# EAGLE design avionics-controller (EAGLE 9.2.2)

## Sheet 1 of 4
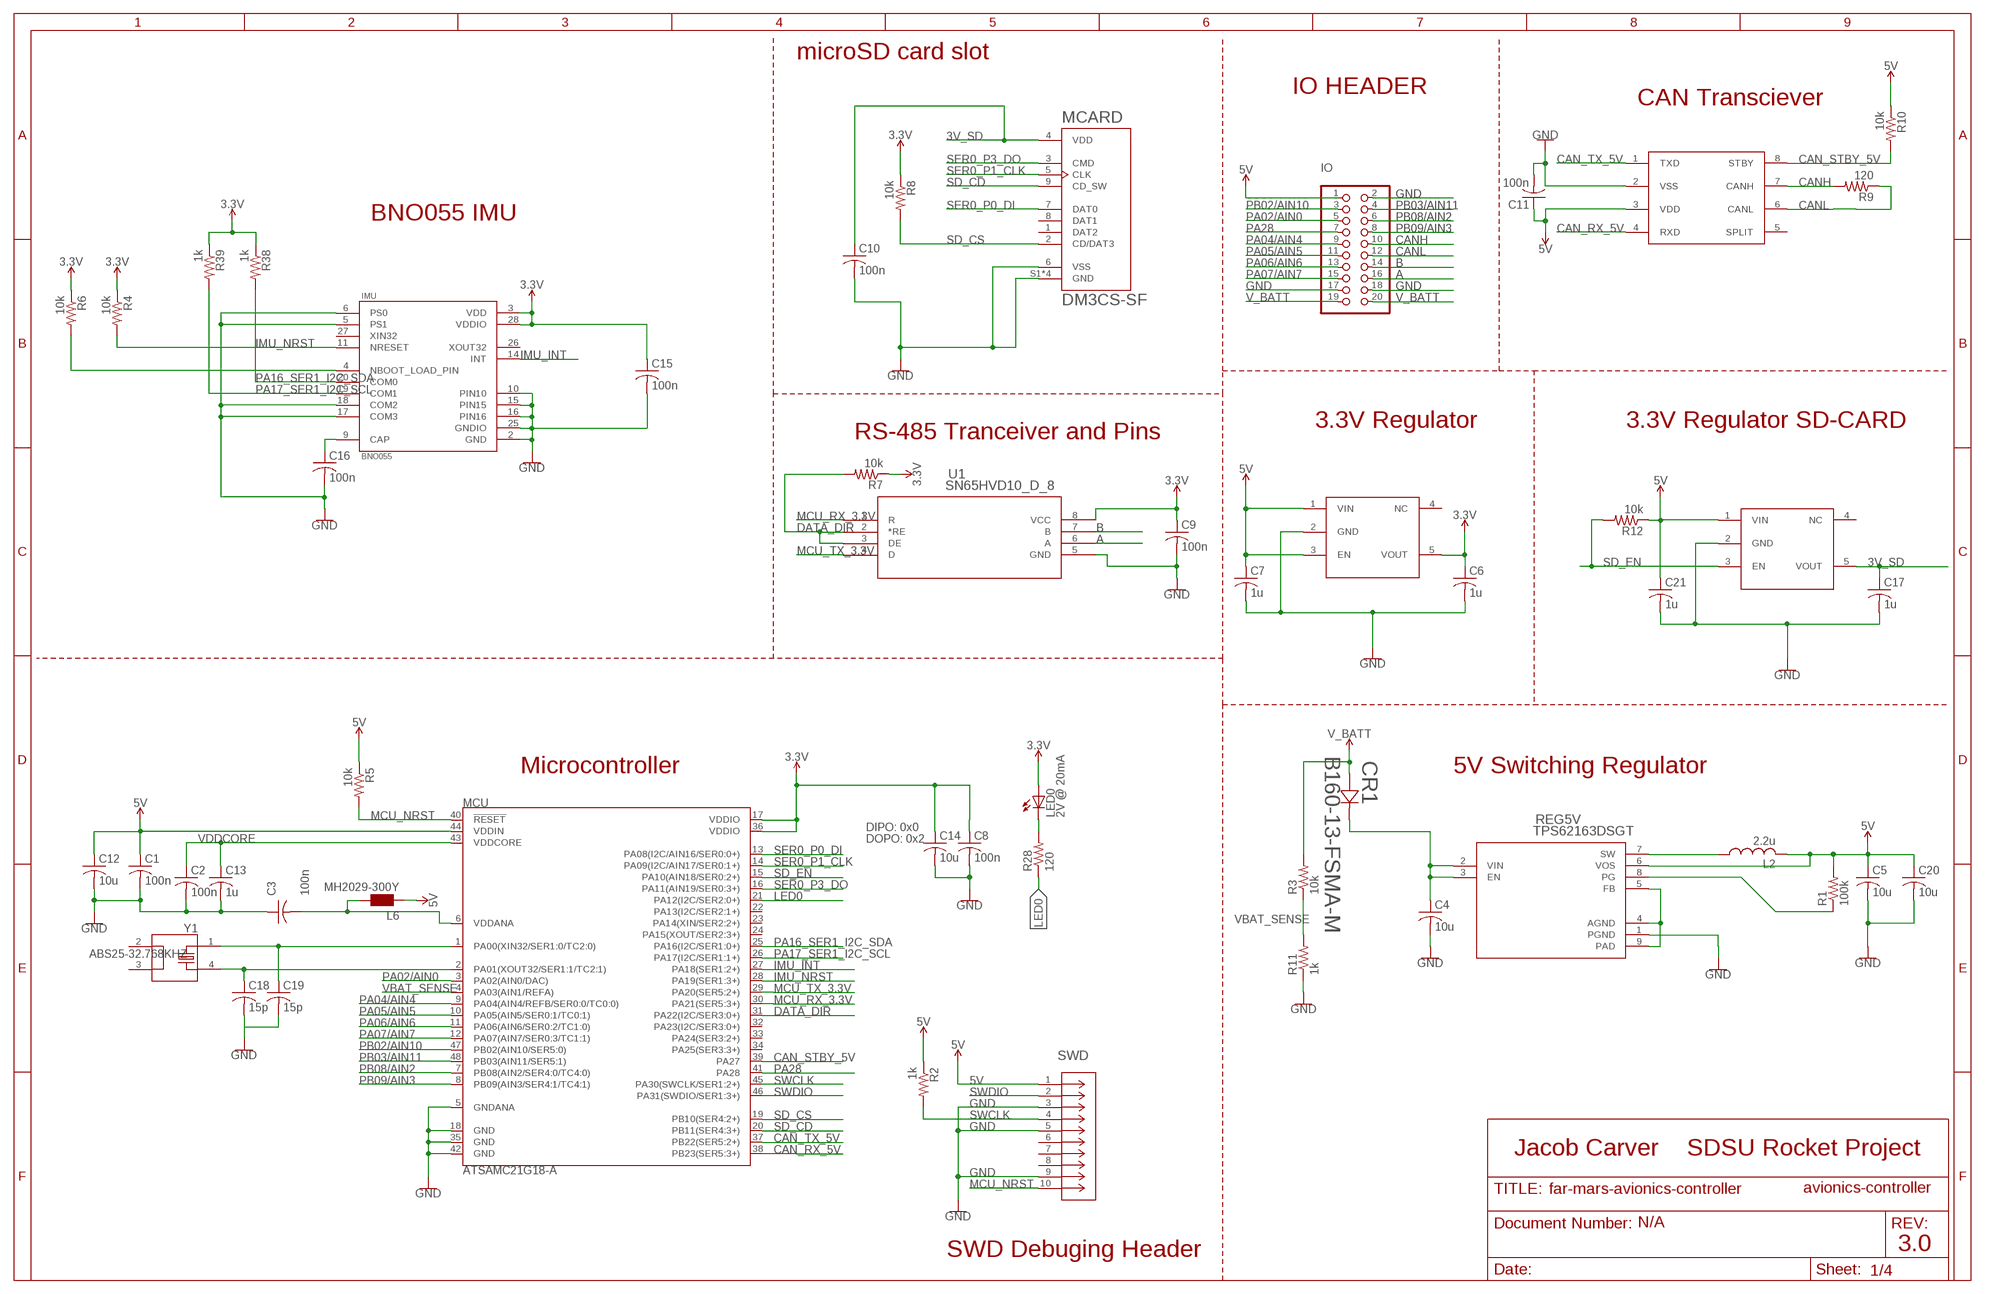
[diagram p0: schematic, sheet 1]

### Parts
3VREG  3.3VREGULATOR  [SOT95P280X110-5]
3VREG-SD  3.3VREGULATOR  [SOT95P280X110-5]
C1  100n  C-USC0402  [C0402]
C2  100n  C-USC0402  [C0402]
C3  100n  C-USC0402  [C0402]
C4  10u  C-USC0603  [C0603]
C5  10u  C-USC0603  [C0603]
C6  1u  C-USC0402  [C0402]
C7  1u  C-USC0402  [C0402]
C8  100n  C-USC0402  [C0402]
C9  100n  C-USC0402  [C0402]
C10  100n  C-USC0402  [C0402]
C11  100n  C-USC0402  [C0402]
C12  10u  C-USC0603  [C0603]
C13  1u  C-USC0402  [C0402]
C14  10u  C-USC0603  [C0603]
C15  100n  C-USC0402  [C0402]
C16  100n  C-USC0402  [C0402]
C17  1u  C-USC0402  [C0402]
C18  15p  C-USC0402  [C0402]
C19  15p  C-USC0402  [C0402]
C20  10u  C-USC0603  [C0603]
C21  1u  C-USC0402  [C0402]
CAN  MCP2561T-E8SOIC  [SOIC127P600X175-8]
CR1  B160-13-FSMA-M  [SMA-M]
IMU  BNO055  [LGA28R50P4X10_380X520X100]
IO  PINHD-2X10/90  [2X10/90]
L2  2.2u  L-USL2012C  [L2012C]
L6  MH2029-300Y  0001_BLM21PG300SN1D_/_MH2029-300Y  [0805]
LED0  2V @ 20mA  LEDCHIPLED_0603  [CHIPLED_0603]
MCARD  DM3CS-SF  [HRS_DM3CS-SF]
MCU  ATSAMC21G18-A  ATSAMD21G-A  [TQFP-48]
R1  100k  R-US_R0402  [R0402]
R2  1k  R-US_R0402  [R0402]
R3  10k  R-US_R0402  [R0402]
R4  10k  R-US_R0402  [R0402]
R5  10k  R-US_R0402  [R0402]
R6  10k  R-US_R0402  [R0402]
R7  10k  R-US_R0402  [R0402]
R8  10k  R-US_R0402  [R0402]
R9  120  R-US_R0402  [R0402]
R10  10k  R-US_R0402  [R0402]
R11  1k  R-US_R0402  [R0402]
R12  10k  R-US_R0402  [R0402]
R28  120  R-US_R0402  [R0402]
R38  1k  R-US_R0402  [R0402]
R39  1k  R-US_R0402  [R0402]
REG5V  TPS62163DSGT  [DSG8_1P6X0P9]
SWD  DEBUG-HEADER  [CONN_MINITEK_2X5_HDR]
U1  SN65HVD10_D_8  [D8]
Y1  ABS25-32.768KHZ  [ABS25-32.768KHZ-6-T]

### Nets
3.3V: 3VREG.5(VOUT) C6.1 C8.1 C9.1 C14.1 C15.1 IMU.3(VDD) IMU.28(VDDIO) LED0.A MCU.17(VDDIO) MCU.36(VDDIO) R4.1 R6.1 R7.1 R8.1 R38.1 R39.1 U1.8(VCC)
3V_SD: 3VREG-SD.5(VOUT) C10.1 C17.1 MCARD.4(VDD)
5V: 3VREG-SD.1(VIN) 3VREG.1(VIN) 3VREG.3(EN) C1.1 C5.1 C7.1 C11.1 C12.1 C20.1 C21.1 CAN.3(VDD) IO.1 L2.2 L6.1 MCU.44(VDDIN) R1.2 R2.1 R5.1 R10.1 R12.1 REG5V.6(VOS) SWD.1
A: IO.16 U1.6(A)
B: IO.14 U1.7(B)
CAN_RX_5V: CAN.4(RXD) MCU.38(PB23(SER5:3+))
CAN_STBY_5V: CAN.8(STBY) MCU.39(PA27) R10.2
CAN_TX_5V: CAN.1(TXD) MCU.37(PB22(SER5:2+))
CANH: CAN.7(CANH) IO.10 R9.2
CANL: CAN.6(CANL) IO.12 R9.1
DATA_DIR: MCU.31(PA22(I2C/SER3:0+)) R7.2 U1.2(*RE) U1.3(DE)
GND: 3VREG-SD.2(GND) 3VREG.2(GND) C1.2 C2.2 C3.1 C4.2 C5.2 C6.2 C7.2 C8.2 C9.2 C10.2 C11.2 C12.2 C13.2 C14.2 C15.2 C16.2 C17.2 C18.2 C19.2 C20.2 C21.2 CAN.2(VSS) IMU.2(GND) IMU.5(PS1) IMU.6(PS0) IMU.10(PIN10) IMU.15(PIN15) IMU.16(PIN16) IMU.17(COM3) IMU.18(COM2) IMU.25(GNDIO) IO.2 IO.17 IO.18 MCARD.6(VSS) MCARD.S1(GND) MCARD.S2(GND) MCARD.S3(GND) MCARD.S5(GND) MCU.5(GNDANA) MCU.18(GND) MCU.35(GND) MCU.42(GND) R11.1 REG5V.1(PGND) SWD.3 SWD.5 SWD.9 U1.5(GND)
IMU_INT: IMU.14(INT) MCU.27(PA18(SER1:2+))
IMU_NRST: IMU.11(NRESET) MCU.28(PA19(SER1:3+)) R4.2
LED0: MCU.21(PA12(I2C/SER2:0+)) R28.1
MCU_NRST: MCU.40(!RESET!) R5.2 SWD.10
MCU_RX_3.3V: MCU.30(PA21(SER5:3+)) U1.1(R)
MCU_TX_3.3V: MCU.29(PA20(SER5:2+)) U1.4(D)
N$1: R1.1 REG5V.8(PG)
N$2: C3.2 L6.2 MCU.6(VDDANA)
N$4: L2.1 REG5V.7(SW)
N$8: REG5V.4(AGND) REG5V.5(FB) REG5V.9(PAD)
N$9: C4.1 CR1.1 REG5V.2(VIN) REG5V.3(EN)
N$10: C19.1 MCU.1(PA00(XIN32/SER1:0/TC2:0)) Y1.1
N$11: C18.1 MCU.2(PA01(XOUT32/SER1:1/TC2:1)) Y1.4
N$15: C16.1 IMU.9(CAP)
N$18: IMU.4(NBOOT_LOAD_PIN) R6.2
N$20: LED0.C R28.2
PA02/AIN0: IO.5 MCU.3(PA02(AIN0/DAC))
PA04/AIN4: IO.9 MCU.9(PA04(AIN4/REFB/SER0:0/TC0:0))
PA05/AIN5: IO.11 MCU.10(PA05(AIN5/SER0:1/TC0:1))
PA06/AIN6: IO.13 MCU.11(PA06(AIN6/SER0:2/TC1:0))
PA07/AIN7: IO.15 MCU.12(PA07(AIN7/SER0:3/TC1:1))
PA16_SER1_I2C_SDA: IMU.20(COM0) MCU.25(PA16(I2C/SER1:0+)) R38.2
PA17_SER1_I2C_SCL: IMU.19(COM1) MCU.26(PA17(I2C/SER1:1+)) R39.2
PA28: IO.7 MCU.41(PA28)
PB02/AIN10: IO.3 MCU.47(PB02(AIN10/SER5:0))
PB03/AIN11: IO.4 MCU.48(PB03(AIN11/SER5:1))
PB08/AIN2: IO.6 MCU.7(PB08(AIN2/SER4:0/TC4:0))
PB09/AIN3: IO.8 MCU.8(PB09(AIN3/SER4:1/TC4:1))
SD_CD: MCARD.9(CD_SW) MCU.20(PB11(SER4:3+))
SD_CS: MCARD.2(CD/DAT3) MCU.19(PB10(SER4:2+)) R8.2
SD_EN: 3VREG-SD.3(EN) MCU.15(PA10(AIN18/SER0:2+)) R12.2
SER0_P0_DI: MCARD.7(DAT0) MCU.13(PA08(I2C/AIN16/SER0:0+))
SER0_P1_CLK: MCARD.5(CLK) MCU.14(PA09(I2C/AIN17/SER0:1+))
SER0_P3_DO: MCARD.3(CMD) MCU.16(PA11(AIN19/SER0:3+))
SWCLK: MCU.45(PA30(SWCLK/SER1:2+)) R2.2 SWD.4
SWDIO: MCU.46(PA31(SWDIO/SER1:3+)) SWD.2
V_BATT: CR1.2 IO.19 IO.20 R3.2
VBAT_SENSE: MCU.4(PA03(AIN1/REFA)) R3.1 R11.2
VDDCORE: C2.1 C13.1 MCU.43(VDDCORE)
Unconnected: 3VREG-SD.4(NC) 3VREG.4(NC) CAN.5(SPLIT) IMU.26(XOUT32) IMU.27(XIN32) MCARD.1(DAT2) MCARD.8(DAT1) MCU.22(PA13(I2C/SER2:1+)) MCU.23(PA14(XIN/SER2:2+)) MCU.24(PA15(XOUT/SER2:3+)) MCU.32(PA23(I2C/SER3:0+)) MCU.33(PA24(SER3:2+)) MCU.34(PA25(SER3:3+)) SWD.6 SWD.7 SWD.8 Y1.2 Y1.3

### Notes on the sheet
- microSD card slot
- IO HEADER
- CAN Transciever
- BNO055 IMU
- 3.3V Regulator | 3.3V Regulator SD-CARD
- RS-485 Tranceiver and Pins
- Microcontroller | 5V Switching Regulator
- DIPO: 0x0
- DOPO: 0x2
- Jacob Carver    SDSU Rocket Project
- far-mars-avionics-controller
- N/A
- SWD Debuging Header | 3.0

## Sheet 2 of 4

## Sheet 3 of 4

## Sheet 4 of 4

## Library data of the parts
3VREG 3VREG-SD = RP_AVIONICS_REV:3.3VREGULATOR
C1-C21 = rcl:C-US: CAPACITOR, American symbol; SPICEPREFIX: C
CAN = RP_AVIONICS_REV:MCP2561T-E
CR1 = RP_AVIONICS_REV:B160-13-F; MANUFACTURER_PART_NUMBER: B16013F; VENDOR: Diodes Inc
IMU = BNO055:BNO055: BNO055 9-axis Absolute Orientation Sensor ( SiP ) w/Sensors and Sensor Fusion; AVAILABILITY: Good; DESCRIPTION: IMU ACCEL/GYRO/MAG I2C 28LGA; MF: Bosch; MP: BNO055; PACKAGE: LGA-28 Bosch; PRICE: 7.78 USD
IO = pinhead:PINHD-2X10: PIN HEADER
L2 = resistor:L-US: INDUCTOR, American symbol
L6 = Protezione:0001_BLM21PG300SN1D_/_MH2029-300Y: BLM21; MONTHLY_USAGE: _____; PART_NUMBER: BLM21PG300SN1D_/_MH2029-300Y; PRICE: _____; SUPPLIER: _____; TYPE: Protezione
LED0 = adafruit:LED: LED OSRAM: - CHIPLED LG R971, LG N971, LY N971, LG Q971, LY Q971, LO R971, LY R971 LH N974, LH R974 LS Q976, LO Q976, LY Q976 LO Q996 - Hyper CHIPLED LW Q18S LB Q993, LB Q99A, LB R99A - SideLED LS A670, LO A670, LY A670, LG A670, LP A670 LB A673, LV A673, LT A673, LW A673 LH A674 LY A675 LS A676, LA A676, LO A676, LY A676, LW A676 LS A679, LY A679, LG A679 - Hyper Micro SIDELED® LS Y876, LA Y876, LO Y876, LY Y876 LT Y87S - SmartLED LW L88C, LW L88S LB L89C, LB L89S, LG L890 LS L89K, LO L89K, LY L89K LS L896, LA L896, LO L896, LY L896 - TOPLED LS T670, LO T670, LY T670, LG T670, LP T670 LSG T670, LSP T670, LSY T670, LOP T670, LYG T670 LG T671, LOG T671, LSG T671 LB T673, LV T673, LT T673, LW T673 LH T674 LS T676, LA T676, LO T676, LY T676, LB T676, LH T676, LSB T676, LW T676 LB T67C, LV T67C, LT T67C, LS T67K, LO T67K, LY T67K, LW E67C LS E67B, LA E67B, LO E67B, LY E67B, LB E67C, LV E67C, LT E67C LW T67C LS T679, LY T679, LG T679 LS T770, LO T770, LY T770, LG T770, LP T770 LB T773, LV T773, LT T773, LW T773 LH T774 LS E675, LA E675, LY E675, LS T675 LS T776, LA T776, LO T776, LY T776, LB T776 LHGB T686 LT T68C, LB T68C - Hyper Mini TOPLED® LB M676 - Mini TOPLED Santana® LG M470 LS M47K, LO M47K, LY M47K Source: http://www.osram.convergy.de/
MCARD = DM3CS-SF:DM3CS-SF: CONN MICRO SD CARD HINGED TYPE; DESCRIPTION: Conn Micro SD Card HDR 8 POS 1.1mm Solder RA SMD Embossed T/R 0.5A; DIGI-KEY_PART_NUMBER: HR1972CT-ND; DIGI-KEY_PURCHASE_URL: https://www.digikey.com/product-detail/en/hirose-electric-co-ltd/DM3CS-SF/HR1972CT-ND/2602740?utm_source=snapeda&utm_medium=aggregator&utm_campaign=symbol; MF: Hirose; MP: DM3CS-SF; PACKAGE: None
MCU = SparkFun-IC-Microcontroller:ATSAMD21G: Atmel SAMD21G SMART ARM-Based Microcontroller The Atmel ® | SMART ™ SAM D21 is a series of low-power microcontrollers using the 32-bit ARM ® Cortex ® -M0+ processor, and ranging from 32- to 64-pins with up to 256KB Flash and 32KB of SRAM. The SAM D21 devices operate at a maximum frequency of 48MHz and reach 2.46 CoreMark/MHz. They are designed for simple and intuitive migration with identical peripheral modules, hex compatible code, identical linear address map and pin compatible migration paths between all devices in the product series. All devices include intelligent and flexible peripherals, Atmel Event System for inter-peripheral signaling, and support for capacitive touch button, slider and wheel user interfaces. Datasheet <https://cdn.sparkfun.com/datasheets/Dev/Arduino/Boards/Atmel-42181-SAM-D21_Datasheet.pdf> SparkFun Products SparkFun SAMD21 Mini Breakout <https://www.sparkfun.com/products/13664> (DEV-13664) SparkFun SAMD21 Dev Breakout <https://www.sparkfun.com/products/13672> (DEV-13672); PROD_ID: IC-13064
R1-R12 R28 R38 R39 = rcl:R-US_: RESISTOR, American symbol; SPICEPREFIX: R
REG5V = RP_AVIONICS_REV:TPS62163DSGT; MANUFACTURER_PART_NUMBER: TPS62163DSGT; VENDOR: Texas Instruments
SWD = senior-design-custom:DEBUG-HEADER; MANUFACTURER_PART_NUMBER: 2002111100010T4LF; VENDOR: FCI
U1 = half-dup-485:SN65HVD10_D_8; DATASHEETURL: httpwww.ti.comlitgpnSN65HVD10; FAMILY_NAME: RS485; GENERIC_PART_NUMBER: SN65HVD10; INDUSTRY_STD_PKG_TYPE: SOIC; MANUFACTURER: Texas Instruments; MANUFACTURER_PART_NUMBER: sn65hvd10_d_8; PACKAGE_DESIGNATOR: D; PIN_COUNT: 8; VENDOR: Texas Instruments
Y1 = crystal-footprint:ABS25-32.768KHZ: Crystal 4-SOJ, 5.50mm pitch; DESCRIPTION: ECX-306X Series 32.768 kHz ±20 ppm 6 pF -40 to +85 °C SMT Tuning Fork Crystal; DIGI-KEY_PART_NUMBER: XC1307CT-ND; DIGI-KEY_PURCHASE_URL: https://www.digikey.com/product-detail/en/ecs-inc/ECS-.327-6-17X-TR/XC1307CT-ND/827771?utm_source=snapeda&utm_medium=aggregator&utm_campaign=symbol; MF: ECS Inc.; MP: ECS-.327-6-17X-TR; PACKAGE: 4-4 ECS International

## Board
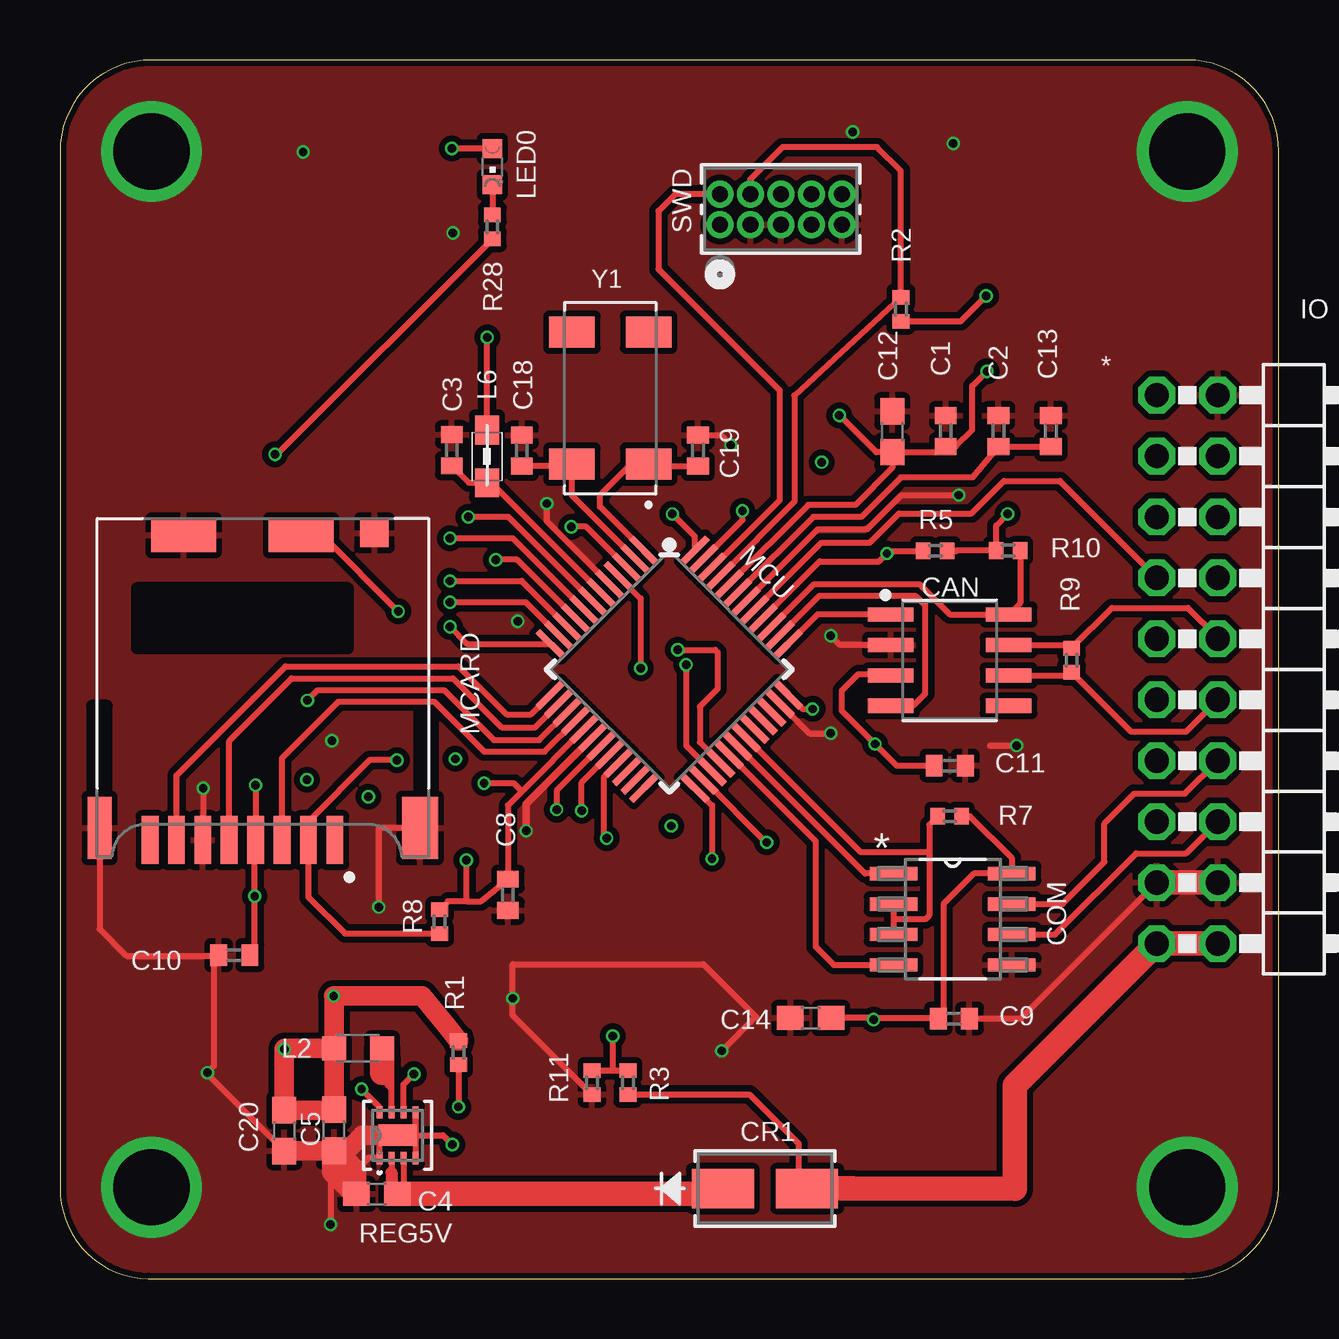
[diagram p1: board, top side]
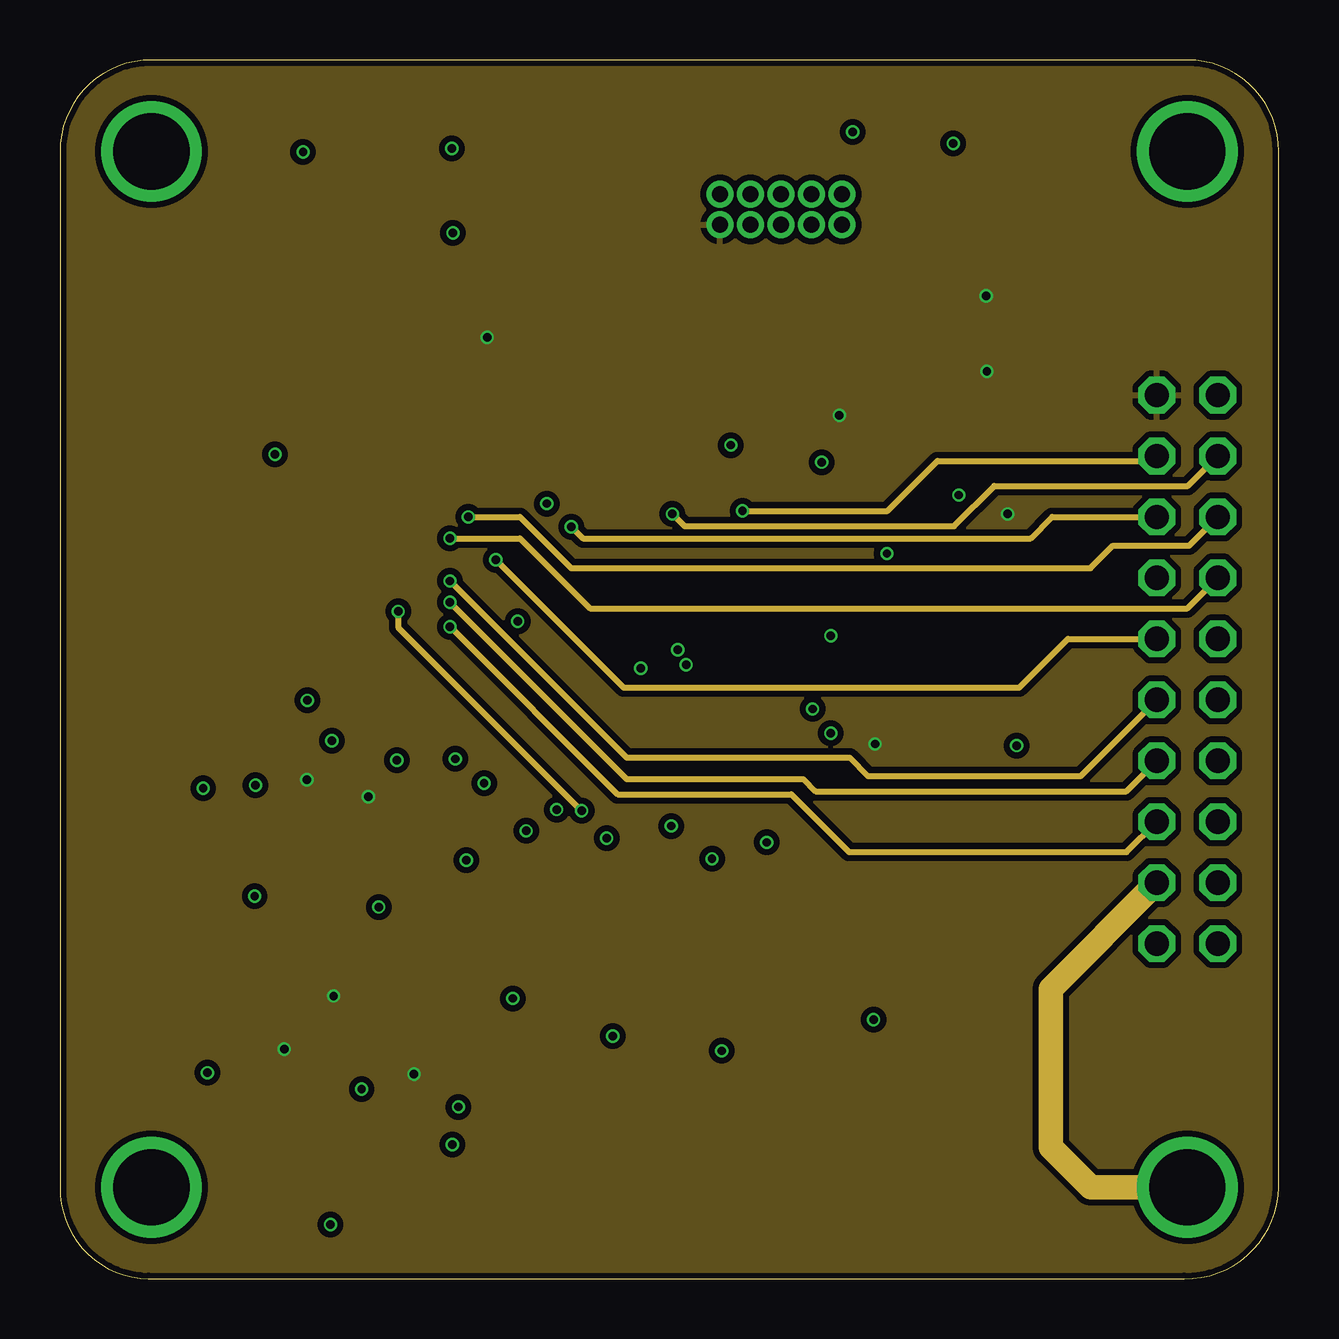
[diagram p2: board, inner layer Route2]
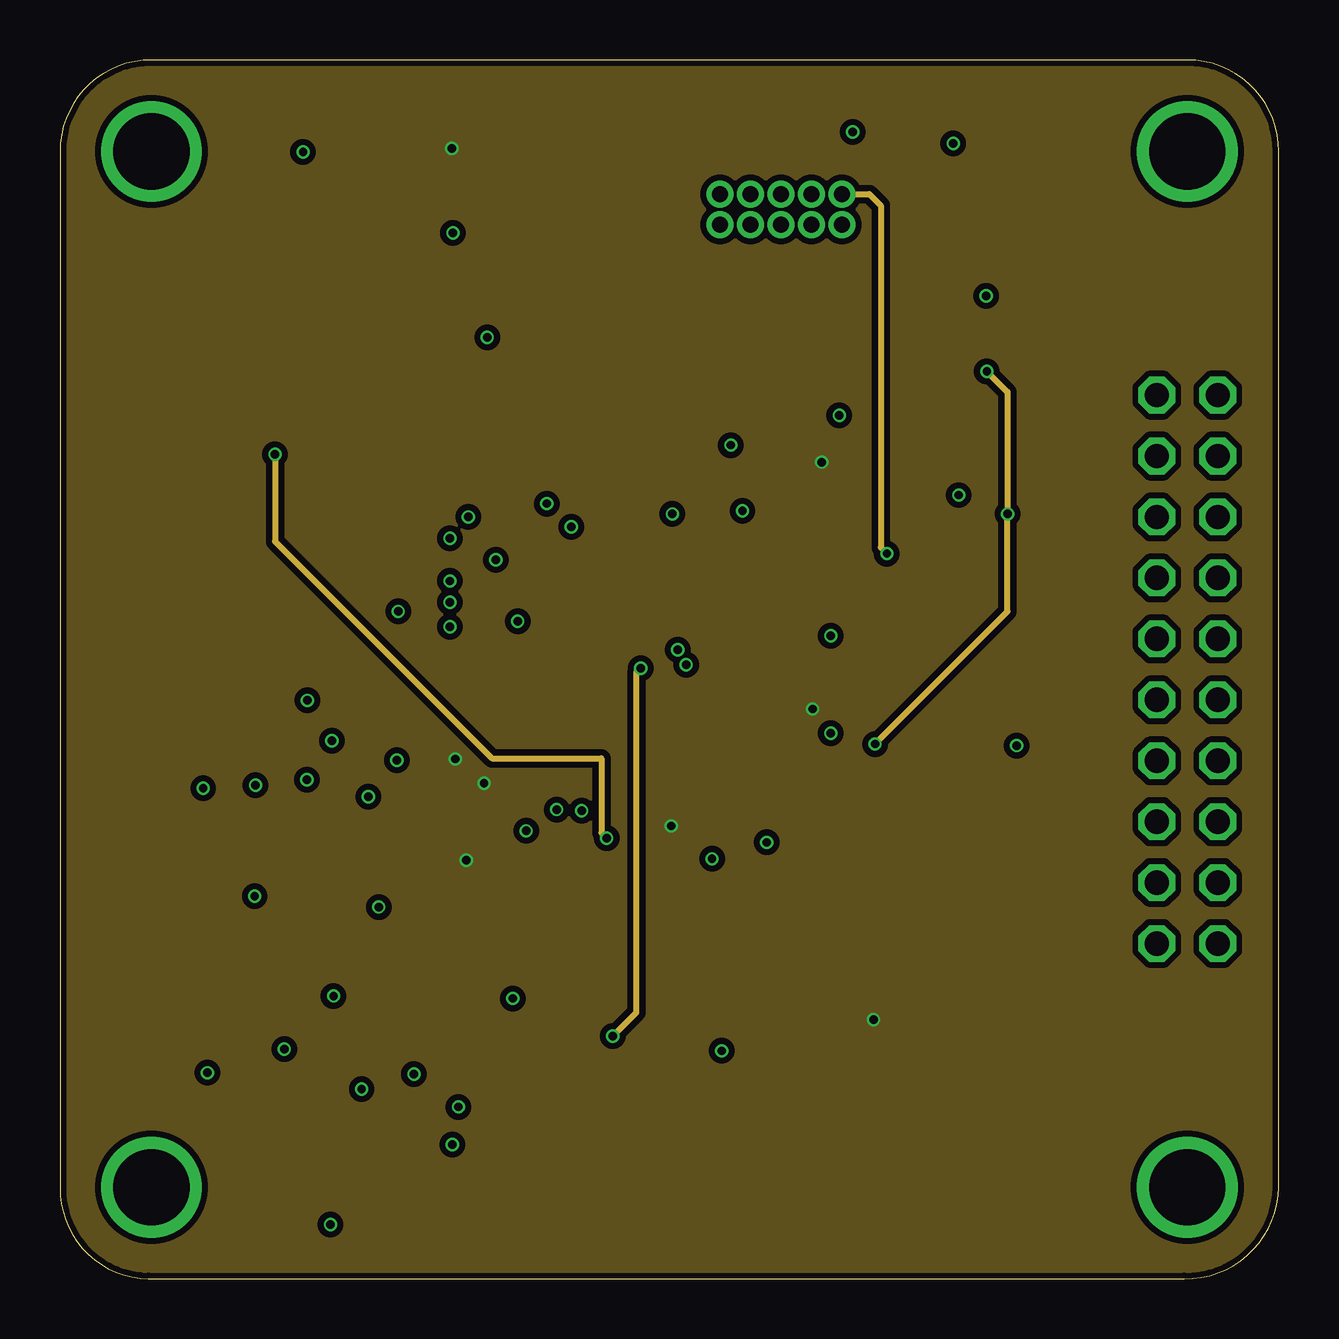
[diagram p3: board, inner layer Route15]
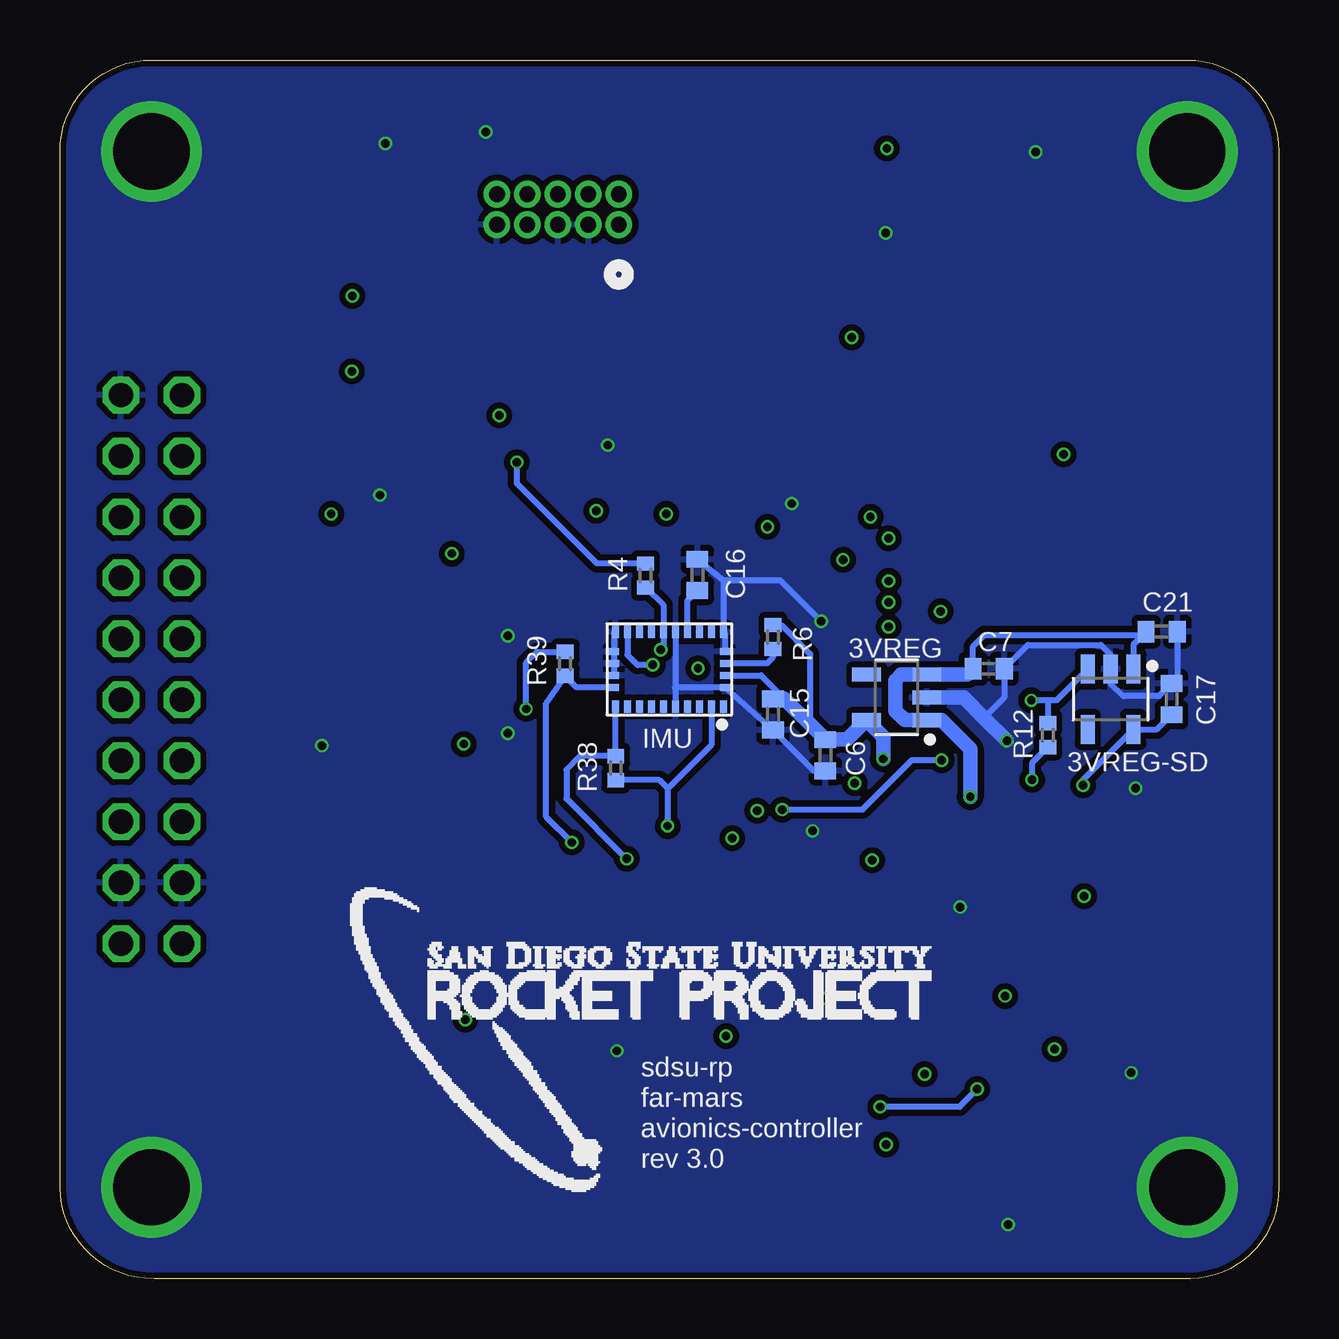
[diagram p4: board, bottom side, seen from below]

Size 50.8 x 50.8 mm. Coordinates in mm from the lower left corner, seen from the top.
Outline: 0,46.99 0,3.81 arc90 3.68,0 46.86,0 arc90 50.8,3.81 50.8,46.99 arc90 46.99,50.8 3.81,50.8 arc90 0,46.99
Copper layers (1*2*15*16): Top 0.035mm / dielectric 0.23mm / Route2 0.035mm / dielectric 0.93mm / Route15 0.035mm / dielectric 0.23mm / Bottom 0.035mm
Design rules "MF_Standard_4_Layer": minimum track width 5mil, minimum drill 10mil, track to track 5mil, track to pad 5mil, pad to pad 5mil, via to via 5mil, smd to smd 0mil, copper to edge 10mil, drill to drill 10mil, minimum pad ring 4mil, minimum via ring 4mil, stop-mask expansion 2mil, vias tented up to drill 25mil, thermal gap 10mil

### Footprints (pad centres in the part's own frame; a part is rotated, then mirrored left to right if it is on the bottom)
SOT95P280X110-5 = smd 1.209 x 0.589: 1 -1.253,0.95; 2 -1.253,0; 3 -1.253,-0.95; 4 1.253,-0.95; 5 1.253,0.95
C0402 = smd 0.7 x 0.9: 1 -0.65,0; 2 0.65,0
C0603 = smd 1.1 x 1: 1 -0.85,0; 2 0.85,0
SOIC127P600X175-8 = smd 1.901 x 0.599: 1 -2.455,1.905; 2 -2.455,0.635; 3 -2.455,-0.635; 4 -2.455,-1.905; 5 2.455,-1.905; 6 2.455,-0.635; 7 2.455,0.635; 8 2.455,1.905
SMA-M = smd 2.587 x 1.63: 1 -1.756,0; 2 1.756,0
LGA28R50P4X10_380X520X100 = smd 0.3 x 0.525: 1 -2.25,1.562; 6 -2.25,-1.562; 7 -1.75,-1.562; 8 -1.25,-1.562; 9 -0.75,-1.562; 10 -0.25,-1.562; 11 0.25,-1.562; 12 0.75,-1.562; 13 1.25,-1.562; 14 1.75,-1.562; 15 2.25,-1.562; 20 2.25,1.562; 21 1.75,1.562; 22 1.25,1.562; 23 0.75,1.562; 24 0.25,1.562; 25 -0.25,1.562; 26 -0.75,1.562; 27 -1.25,1.562; 28 -1.75,1.562 | smd 0.425 x 0.3: 2 -2.312,0.75; 3 -2.312,0.25; 4 -2.312,-0.25; 5 -2.312,-0.75; 16 2.312,-0.75; 17 2.312,-0.25; 18 2.312,0.25; 19 2.312,0.75
2X10/90 = drill 1.016 octagon: 1 -11.43,-6.35; 2 -11.43,-3.81; 3 -8.89,-6.35; 4 -8.89,-3.81; 5 -6.35,-6.35; 6 -6.35,-3.81; 7 -3.81,-6.35; 8 -3.81,-3.81; 9 -1.27,-6.35; 10 -1.27,-3.81; 11 1.27,-6.35; 12 1.27,-3.81; 13 3.81,-6.35; 14 3.81,-3.81; 15 6.35,-6.35; 16 6.35,-3.81; 17 8.89,-6.35; 18 8.89,-3.81; 19 11.43,-6.35; 20 11.43,-3.81
L2012C = smd 1 x 1: 1 -1,0; 2 1,0
0805 = smd 1.2 x 1: 1 -1.1,0; 2 1.1,0
CHIPLED_0603 = smd 0.8 x 0.8: A 0,-0.75; C 0,0.75
HRS_DM3CS-SF = smd 0.7 x 2: 1 3.2,-6.35; 2 2.1,-6.35; 3 1,-6.35; 4 -0.1,-6.35; 5 -1.2,-6.35; 6 -2.3,-6.35; 7 -3.4,-6.35; 8 -4.5,-6.35 | smd 2.7 x 1.4: 9 1.8,6.35; S3 -3.1,6.35 | smd 1 x 2.6: S1 -6.6,-5.85 | smd 1.5 x 2.6: S2 6.75,-5.85 | smd 1.2 x 1.2: S5 4.85,6.45
TQFP-48 = smd 1.5 x 0.28: 1 -4.25,2.75; 2 -4.25,2.25; 3 -4.25,1.75; 4 -4.25,1.25; 5 -4.25,0.75; 6 -4.25,0.25; 7 -4.25,-0.25; 8 -4.25,-0.75; 9 -4.25,-1.25; 10 -4.25,-1.75; 11 -4.25,-2.25; 12 -4.25,-2.75; 25 4.25,-2.75; 26 4.25,-2.25; 27 4.25,-1.75; 28 4.25,-1.25; 29 4.25,-0.75; 30 4.25,-0.25; 31 4.25,0.25; 32 4.25,0.75; 33 4.25,1.25; 34 4.25,1.75; 35 4.25,2.25; 36 4.25,2.75 | smd 0.28 x 1.5: 13 -2.75,-4.25; 14 -2.25,-4.25; 15 -1.75,-4.25; 16 -1.25,-4.25; 17 -0.75,-4.25; 18 -0.25,-4.25; 19 0.25,-4.25; 20 0.75,-4.25; 21 1.25,-4.25; 22 1.75,-4.25; 23 2.25,-4.25; 24 2.75,-4.25; 37 2.75,4.25; 38 2.25,4.25; 39 1.75,4.25; 40 1.25,4.25; 41 0.75,4.25; 42 0.25,4.25; 43 -0.25,4.25; 44 -0.75,4.25; 45 -1.25,4.25; 46 -1.75,4.25; 47 -2.25,4.25; 48 -2.75,4.25
R0402 = smd 0.6 x 0.7: 1 -0.5,0; 2 0.5,0
DSG8_1P6X0P9 = smd 0.508 x 0.254: 1 -0.95,0.75; 2 -0.95,0.25; 3 -0.95,-0.25; 4 -0.95,-0.75; 5 0.95,-0.75; 6 0.95,-0.25; 7 0.95,0.25; 8 0.95,0.75 | smd 0.9 x 1.6: 9 0,0
CONN_MINITEK_2X5_HDR = drill 0.66 pad 1.118: 1 -2.54,-0.635; 2 -2.54,0.635; 3 -1.27,-0.635; 4 -1.27,0.635; 5 0,-0.635; 6 0,0.635; 7 1.27,-0.635; 8 1.27,0.635; 9 2.54,-0.635; 10 2.54,0.635
D8 = smd 1.981 x 0.559: 1 -2.464,1.905; 2 -2.464,0.635; 3 -2.464,-0.635; 4 -2.464,-1.905; 5 2.464,-1.905; 6 2.464,-0.635; 7 2.464,0.635; 8 2.464,1.905
ABS25-32.768KHZ-6-T = smd 1.3 x 1.9: 1 -2.75,-1.6; 2 2.75,-1.6; 3 2.75,1.6; 4 -2.75,1.6

### Placement (x,y rotation side)
3VREG  15.93,24.23 180 bottom
3VREG-SD  7.01,24.16 270 bottom
C1  36.92,35.33 90 top
C2  39.12,35.33 90 top
C3  16.33,34.53 270 top
C4  13.21,3.53 180 top
C5  11.42,6.2 270 top
C6  18.9,21.82 270 bottom
C7  12.09,25.43 0 bottom
C8  18.67,16 270 top
C9  37.26,10.85 0 top
C10  7.26,13.49 180 top
C11  37.08,21.39 0 top
C12  34.7,35.31 90 top
C13  41.3,35.33 90 top
C14  31.29,10.87 180 top
C15  21.08,23.52 270 bottom
C16  24.23,29.34 90 bottom
C17  4.47,24.16 90 bottom
C18  19.25,34.52 90 top
C19  26.59,34.52 90 top
C20  9.35,6.17 270 top
C21  4.88,26.97 0 bottom
CAN  37.08,25.78 0 top
CR1  29.39,3.76 0 top
IMU  25.4,25.4 180 bottom
IO  52.07,25.4 270 top
L2  12.42,9.6 180 top
L6  17.79,34.28 270 top
LED0  18.02,46.35 180 top
MCARD  8.26,24.64 0 top
MCU  25.4,25.4 315 top
R1  16.61,9.42 90 top
R2  35.05,40.41 90 top
R3  23.67,8.18 270 top
R4  26.39,29.31 270 bottom
R5  36.49,30.34 180 top
R6  21.08,26.75 270 bottom
R7  37.08,19.28 180 top
R8  15.82,14.88 270 top
R9  42.16,25.78 90 top
R10  39.52,30.35 0 top
R11  22.17,8.18 90 top
R12  9.63,22.66 90 bottom
R28  18.02,43.84 90 top
R38  27.64,21.29 90 bottom
R39  29.74,25.63 270 bottom
REG5V  14.07,5.98 90 top
SWD  30.05,44.58 0 top
U1  37.21,14.99 0 top
U$6  [RP-LOGO]  38.66,3.66 0 bottom
Y1  22.94,36.7 90 top

### Tracks (layer width: path | path; a pad name or v marks a point on that pad's centre or on a via)
3.3V  (via drill 0.35)
  Top 0.254: MCU.36 30.94,23.75 v31.37,23.75 | MCU.17 19.26,20.32 | 19.26,20.32 18.67,19.73 C8.1 17.55,15.73 16.94,15.73 | 19.26,20.32 18.92,20.65 v17.68,20.65 | 16.94,15.73 v16.94,17.45 | C14.1 33.83,10.87 v33.91,10.79 33.96,10.85 C9.1 36.83,11.26 36.83,15.62 38.1,16.89 U1.8 39.67,17.54 37.93,19.28 R7.1 | 16.94,15.73 16.17,15.73 R8.1 | LED0.A 16.34,47.1 v16.33,47.12
  Bottom 0.254: C15.1 21.1,24.19 | 25.46,20.43 25.46,18.88 v25.48,18.87 | v31.75,34.04 31.75,33.15 28.41,29.81 R4.1 | 25.46,20.43 25.82,20.79 R38.1 | IMU.28 23.65,22.25 25.46,20.43 | 19.49,23.06 19.53,23.1 19.53,26.05 20.73,27.25 R6.1 | 20.62,24.19 21.58,25.15 IMU.3 | R39.1 30.92,26.13 31.37,25.68 v31.37,23.75
  Bottom 0.61: v16.48,21.67 16.48,22.59 3VREG.5 17.99,22.47 C6.1 19.49,23.06 20.62,24.19 21.1,24.19
  pour Route15 (isolate 0.254): 0,0 50.8,0 50.8,50.8 0,50.8
3V_SD  (via drill 0.35)
  Top 0.254: C10.1 8.11,13.69 v8.11,15.95 8.11,18.25 MCARD.4 | MCARD.4 | v8.15,20.57 MCARD.4
  Bottom 0.254: C17.1 5.07,22.9 3VREG-SD.5 8.15,20.81 v8.15,20.57
5V  (via drill 0.35)
  Top 0.254: MCU.44 31.2,32.26 33.15,32.26 34.7,33.81 C12.1 | C12.1 36.89,34.46 C1.1 37.32,34.68 38.02,35.38 38.02,37.21 v38.63,37.82 | R5.1 37.35,30.33 37.38,30.35 R10.1 39.02,31.4 v39.5,31.88 | R2.1 37.55,39.91 v38.61,40.97 | REG5V.6 14.32,8.1 v14.76,8.53 | C12.1 34.02,34.46 v32.49,35.99 | CAN.3 34.58,25.2 33.27,25.2 32.59,24.51 32.59,23.67 v33.97,22.29 34.87,21.39 C11.1 | L6.1 17.79,39.23 v17.8,39.24
  Top 0.813: L2.2 11.42,11.77 v11.4,11.79 15.1,11.79 16.05,10.62 R1.2 | L2.2 C5.1 11.39,7.02 C20.1 v9.35,9.58 9.37,9.6 L2.2
  Route15 0.254: v38.63,37.82 39.5,36.96 v39.5,31.88 39.5,27.81 v33.97,22.29
  Bottom 0.254: 3VREG-SD.1 6.06,26.44 C21.1 5.68,26.82 12.27,26.82 12.74,26.35 C7.1 | R12.1 10.29,21.5 v10.29,20.8
  Bottom 0.61: v12.85,20.09 12.85,22.07 14.06,23.28 3VREG.1 15.59,23.28 15.98,23.67 15.98,24.94 15.74,25.18 3VREG.3 12.98,25.18 C7.1
  pour Route2 (isolate 0.254): 0,0 50.8,0 50.8,50.8 0,50.8
A
  Top 0.254: U1.6 41.48,14.35 44.86,17.73 46.94,17.73 IO.16
B
  Top 0.254: U1.7 41.78,15.62 43.54,17.37 43.54,18.97 44.78,20.22 46.89,20.22 IO.14
CAN_RX_5V
  Top 0.254: CAN.4 35.56,23.88 36.07,24.38 36.07,28.07 35.69,28.45 31.63,28.45 MCU.38
CAN_STBY_5V
  Top 0.254: MCU.39 31.43,28.96 35.81,28.96 37.08,27.69 CAN.8 40.02,28.17 R10.2
CAN_TX_5V
  Top 0.254: CAN.1 31.57,27.69 MCU.37
CANH
  Top 0.254: CAN.7 41.95,26.42 R9.2 43.85,27.96 47.02,27.96 48.26,26.72 IO.10
CANL
  Top 0.254: CAN.6 41.95,25.15 R9.1 44.64,22.81 46.94,22.81 IO.12
DATA_DIR
  Top 0.254: U1.2 34.75,14.99 | 34.75,14.99 U1.3 | 36.23,17.78 36.23,15.15 36.07,14.99 34.75,14.99 | MCU.31 33.37,17.78 36.23,17.78 | 36.23,17.78 36.23,18.93 R7.2
GND  (via drill 0.35, 3.17)
  Top 0.254: CAN.2 32.51,26.42 v32.13,26.8 | MCU.35 31.25,22.73 v32.13,22.73 | 38.77,22.23 v39.88,22.23 | MCU.42 31.6,31.24 33.66,31.24 35.08,32.66 v37.47,32.66 | 39.88,13.08 U1.5 | MCU.5 20.3,31.57 v20.3,32.31 | MCARD.S2 13.28,18.79 v13.28,15.49 | 13.61,5.97 13.32,5.68 REG5V.1 12.86,5.03 12.36,4.53 | 11.42,4.47 11.28,4.33 v11.28,2.26 | v27.58,9.5 28.96,10.87 29.06,10.87 26.82,13.11 18.87,13.11 v18.87,11.68 18.87,10.97 21.72,8.12 21.73,8.12 R11.1 | C19.2 27.54,35.17 v27.96,34.75 | MCARD.S1 1.66,14.58 2.77,13.46 6.41,13.46 6.41,8.85 v6.15,8.59 6.15,8.52 C20.2 | v5.97,20.45 5.97,18.3 MCARD.6 | C9.2 40.06,10.85 IO.17
  Top 0.305: MCU.18 19.43,19.79 v19.43,18.67
  Top 0.813: 13.61,5.97 12.6,5.97 11.98,5.35 C5.2 11.39,5.32 C20.2 | C4.2 12.36,4.53 12.09,4.8
  Top 1.016: C4.2 11.42,4.47 C5.2 | IO.17 IO.18
  Route2 1.016: IO.17 41.3,12.09 41.3,5.49 42.98,3.81 v46.99,3.81
  Bottom 0.254: 11.27,22.37 v11.33,22.43 | IMU.5 23.09,26.9 IMU.6 23.15,29.11 | 25.17,26.94 IMU.10 25.15,24.62 | 25.15,24.62 25.17,24.64 25.16,24.65 IMU.2 23.06,24.65 C15.2 19.38,21.17 C6.2 | 25.15,24.62 IMU.25 | C16.2 23.15,29.11 | 5.99,20.46 v5.97,20.45 | C21.2 4.23,25.05 C17.2 4.99,24.28 6.48,24.28 7.01,24.82 3VREG-SD.2 7.01,26.01 7.42,26.42 10.45,26.42 C7.2 11.44,24.22 12.28,23.38 | IMU.15 27.71,26.9 IMU.16 IMU.17 IMU.18 | v19.07,27.41 20.77,29.11 23.15,29.11
  Bottom 0.61: 3VREG.2 13.13,24.23 12.28,23.38 v11.33,22.43
  other vias: 37.24,47.32 16.38,43.59 33.05,47.8 10.13,46.96 3.81,3.81 3.81,46.99 46.99,46.99
  pour Bottom (isolate 0.254): 0,0 50.8,0 50.8,50.8 0,50.8
  pour Top (isolate 0.254): 0,0 50.8,0 50.8,50.8 0,50.8
IMU_INT  (via drill 0.35)
  Top 0.254: v26.1,25.59 26.1,22.23 MCU.27
  Bottom 0.254: IMU.14 27.15,26.01 26.72,25.58 26.71,25.59 v26.1,25.59
IMU_NRST  (via drill 0.35)
  Top 0.254: MCU.28 26.67,22.36 26.67,23.85 27.41,24.59 27.41,26.11 27.3,26.21 v25.76,26.21
  Bottom 0.254: R4.2 25.65,28.07 IMU.11 25.65,26.32 v25.76,26.21
LED0  (via drill 0.35)
  Top 0.254: v22.78,18.36 22.66,18.49 22.66,20.89 MCU.21 | R28.1 9.05,34.37 v8.97,34.37
  Route15 0.254: v22.78,18.36 22.57,18.58 22.57,21.69 18.01,21.69 8.97,30.73 v8.97,34.37
MCU_NRST  (via drill 0.35)
  Top 0.254: R5.2 34.58,30.34 v34.47,30.23 34.14,29.9 31.66,29.9 MCU.40
  Route15 0.254: SWD.10 33.73,45.21 34.21,44.73 34.21,30.48 v34.47,30.23
MCU_RX_3.3V
  Top 0.254: U1.1 33.55,16.89 MCU.30
MCU_TX_3.3V
  Top 0.254: MCU.29 31.5,18.24 31.5,13.84 32.26,13.08 U1.4
N$1  (via drill 0.35)
  Top 0.254: REG5V.8 13.32,7.15 v12.57,7.9 | R1.1 v16.61,7.16
  Bottom 0.254: v12.57,7.9 13.31,7.16 v16.61,7.16
N$2
  Top 0.254: 16.53,33.68 C3.2 17.04,33.18 L6.2 17.98,33.18 MCU.6
N$4
  Top 0.254: REG5V.7 13.82,7.9 | 13.82,7.9 13.82,9.2 L2.1 | 13.82,7.9 13.42,8.3 13.42,8.6
  Top 1.016: L2.1 13.42,8.6 13.44,8.59
N$8  (via drill 0.35)
  Top 0.254: 14.57,5.98 14.82,5.73 REG5V.4 REG5V.5 14.82,6.24 14.57,5.98 | 14.57,5.98 REG5V.9 15.96,5.98 v16.36,5.59
N$9
  Top 0.254: REG5V.2 13.82,4.42 | REG5V.3 14.32,3.79 C4.1
  Top 0.508: 13.82,4.42 13.82,3.77 C4.1
  Top 1.016: 27.35,3.48 CR1.1 27.4,3.53 C4.1
N$10
  Top 0.254: MCU.1 22.5,32.19 22.5,32.66 23.79,33.95 Y1.1 24.62,33.87 C19.1
N$11
  Top 0.254: MCU.2 21.34,32.65 Y1.4 21.25,33.87 C18.1
N$15
  Bottom 0.254: C16.1 24.65,28.27 IMU.9
N$18
  Bottom 0.254: IMU.4 21.33,25.65 21.08,25.9 R6.2
N$20
  Top 0.254: LED0.C R28.2
PA02/AIN0  (via drill 0.35)
  Top 0.254: MCU.3 21.93,31.34 v21.31,31.34
  Route2 0.254: v21.31,31.34 21.79,30.86 40.46,30.86 41.35,31.75 IO.5
PA04/AIN4  (via drill 0.35)
  Top 0.254: MCU.9 19.06,29.97 v18.16,29.97
  Route2 0.254: v18.16,29.97 23.5,24.64 39.98,24.64 42.01,26.67 IO.9
PA05/AIN5  (via drill 0.35)
  Top 0.254: v16.26,29.08 19.24,29.08 MCU.10
  Route2 0.254: v16.26,29.08 23.62,21.72 32.92,21.72 33.68,20.95 42.55,20.95 IO.11
PA06/AIN6  (via drill 0.35)
  Top 0.254: MCU.11 19.42,28.19 v16.26,28.19
  Route2 0.254: v16.26,28.19 23.62,20.83 30.99,20.83 31.5,20.32 44.45,20.32 IO.13
PA07/AIN7  (via drill 0.35)
  Top 0.254: v16.26,27.18 16.97,26.46 MCU.12
  Route2 0.254: v16.26,27.18 23.24,20.19 30.48,20.19 32.89,17.78 44.45,17.78 IO.15
PA16_SER1_I2C_SDA  (via drill 0.35)
  Top 0.254: MCU.25 27.18,19.73 v27.18,17.5
  Bottom 0.254: IMU.20 27.64,23.82 R38.2 29.12,21.79 29.69,21.21 29.69,20.02 v27.18,17.5
PA17_SER1_I2C_SCL  (via drill 0.35)
  Top 0.254: MCU.26 29.43,18.19 v29.46,18.19
  Bottom 0.254: v29.46,18.19 30.53,19.25 30.53,23.99 R39.2 29.27,24.65 IMU.19
PA28
  Top 0.254: MCU.41 31.74,30.68 33.76,30.68 34.98,31.9 38,31.9 39.34,33.25 41.68,33.25 IO.7
PB02/AIN10  (via drill 0.35)
  Top 0.254: MCU.47 28.45,31.63 v28.45,32
  Route2 0.254: v28.45,32 34.49,32 36.58,34.09 45.52,34.09 IO.3
PB03/AIN11  (via drill 0.35)
  Top 0.254: MCU.48 26.46,30.94 v25.53,31.88
  Route2 0.254: v25.53,31.88 26.04,31.37 37.26,31.37 38.94,33.05 47.02,33.05 IO.4
PB08/AIN2  (via drill 0.35)
  Top 0.254: MCU.7 18.7,31.75 v17.02,31.75
  Route2 0.254: v17.02,31.75 19.18,31.75 21.31,29.62 42.95,29.62 43.89,30.56 47.07,30.56 IO.6
PB09/AIN3  (via drill 0.35)
  Top 0.254: MCU.8 18.88,30.86 v16.26,30.86
  Route2 0.254: v16.26,30.86 19.18,30.86 22.1,27.94 46.99,27.94 IO.8
SD_CD  (via drill 0.35)
  Top 0.254: MCARD.9 10.92,30.99 v14.1,27.81 | v21.74,19.51 21.74,20.68 MCU.20
  Route2 0.254: v21.74,19.51 14.1,27.15 v14.1,27.81
SD_CS  (via drill 0.35)
  Top 0.254: MCARD.2 10.36,18.44 | 10.36,18.44 10.36,19.07 12.9,21.61 v14.05,21.61 | MCU.19 20.7,20.35 v20.7,19.56 | 10.36,18.44 10.36,18.43 10.36,15.9 11.88,14.38 R8.2
  Bottom 0.254: v20.7,19.56 17.35,19.56 15.29,21.61 v14.05,21.61
SD_EN  (via drill 0.35)
  Top 0.254: v10.31,24.11 10.74,24.54 16,24.54 18.09,22.45 19.98,22.45 MCU.15
  Bottom 0.254: 3VREG-SD.3 9.26,24.11 9.6,24.11 | 9.6,24.11 v10.31,24.11 | 9.6,24.11 9.63,24.08 R12.2
SER0_P0_DI
  Top 0.254: MCARD.7 4.86,20.98 8.06,24.19 9.4,25.53 16.61,25.53 18.62,23.52 19.63,23.52 MCU.13
SER0_P1_CLK
  Top 0.254: MCARD.5 7.05,22.42 9.65,25.02 16.38,25.02 18.41,22.99 19.8,22.99 MCU.14
SER0_P3_DO
  Top 0.254: MCU.16 20.2,21.97 17.68,21.97 15.6,24.05 11.61,24.05 9.26,21.7 MCARD.3
SWCLK
  Top 0.254: SWD.4 28.78,45.82 30.12,47.17 34.06,47.17 35.05,46.18 R2.2 30.61,36.82 30.61,32.38 MCU.45
SWDIO
  Top 0.254: SWD.2 25.65,45.21 24.94,44.5 24.94,42.09 30,37.03 30,32.44 27.2,29.64 MCU.46
V_BATT
  Top 0.254: R3.2 28.75,7.68 30.79,5.64 30.79,4.12 CR1.2
  Top 1.016: CR1.2 33.05,3.76 39.81,3.74 39.81,8.06 IO.19 IO.20
VBAT_SENSE  (via drill 0.35)
  Top 0.254: MCU.4 24.21,28.36 v24.21,25.45 | R11.2 23.04,8.68 | 23.04,8.68 R3.1 | v23.04,10.11 23.04,8.68
  Route15 0.254: v23.04,10.11 24.03,11.1 24.03,25.27 v24.21,25.45
VDDCORE
  Top 0.254: MCU.43 31.4,31.75 33.4,31.75 35.05,33.4 38.04,33.4 C2.1 C13.1

### Text on the board
tPlace: * | COM
bPlace: sdsu-rp | far-mars | avionics-controller | rev 3.0